# Altium schematic sheet InkJetFin - MCU - MKL05Z32VLF4.SchDoc
size A
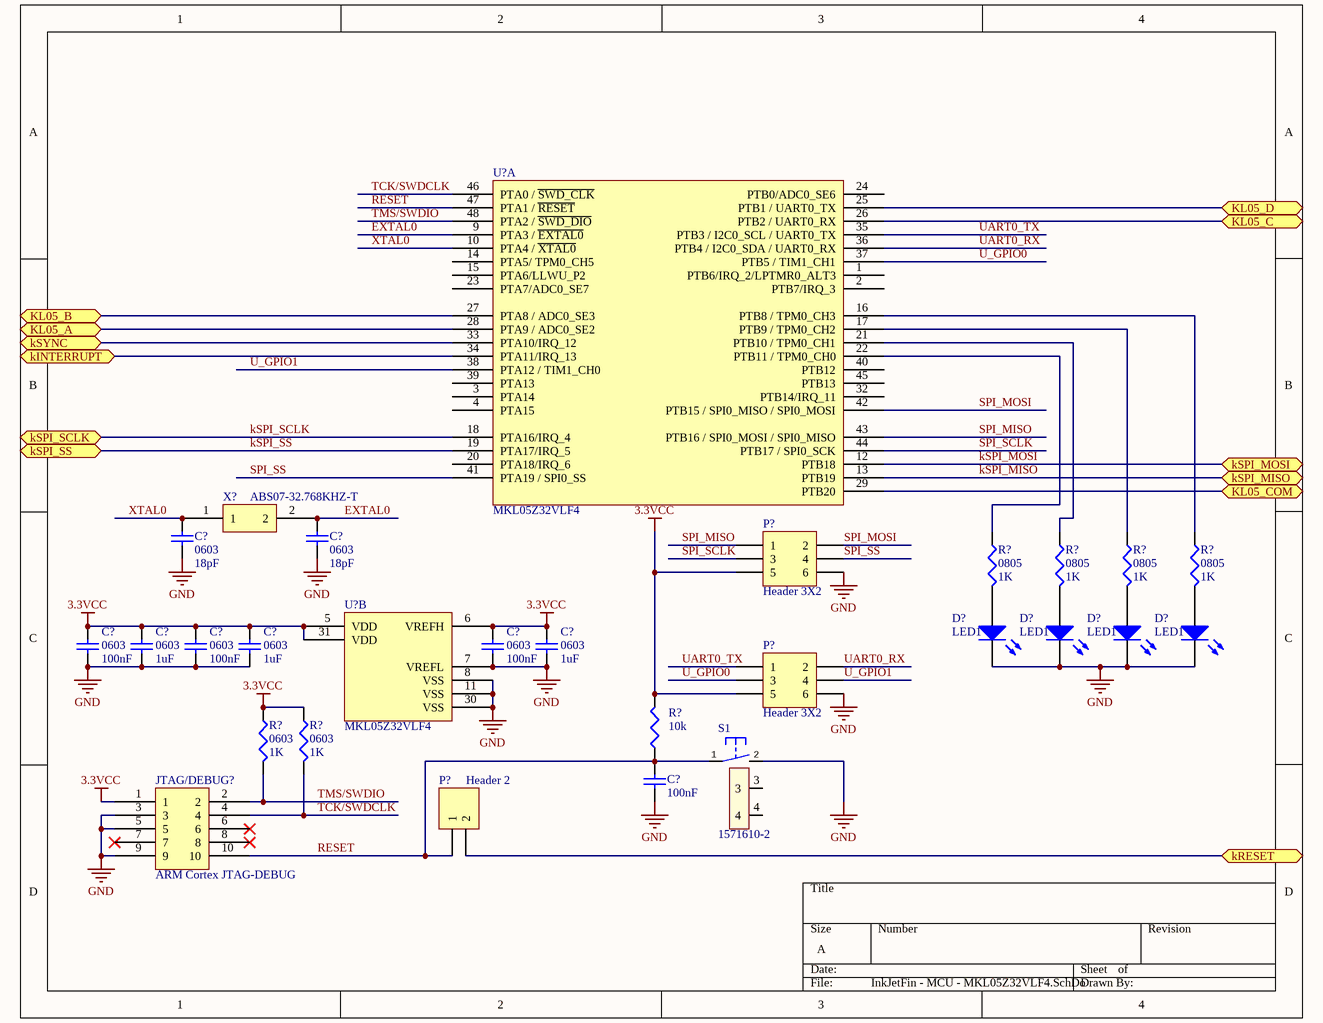
[diagram p0: InkJetFin - MCU - MKL05Z32VLF4.SchDoc]

## Parts
(Parts that share a designator on the sheet are numbered #1, #2 ... from top to bottom, then left to right.)
C?#1  0603  value 18pF  [1608[0603]]
C?#2  0603  value 18pF  [1608[0603]]
C?#3  0603  value 100nF  [1608[0603]]
C?#4  0603  value 1uF  [1608[0603]]
C?#5  0603  value 100nF  [1608[0603]]
C?#6  0603  value 1uF  [1608[0603]]
C?#7  0603  value 100nF  [1608[0603]]
C?#8  0603  value 1uF  [1608[0603]]
C?#9  value 100nF  [1608[0603]]  (hidden comment: Cap Semi)
D?#1  LED1  [SM 0805 polarized]
D?#2  LED1  [SM 0805 polarized]
D?#3  LED1  [SM 0805 polarized]
D?#4  LED1  [SM 0805 polarized]
JTAG/DEBUG?  ARM Cortex JTAG-DEBUG  [FTSH-105-XX-X-DV]
P?#1  Header 3X2  [HDR2X3]
P?#2  Header 3X2  [HDR2X3]
P?#3  Header 2  [HDR1X2]
R?#1  0805  value 1K  [SM 0805 - gap trimmed]
R?#2  0805  value 1K  [SM 0805 - gap trimmed]
R?#3  0805  value 1K  [SM 0805 - gap trimmed]
R?#4  0805  value 1K  [SM 0805 - gap trimmed]
R?#5  0603  value 1K  [J1-0603]
R?#6  0603  value 1K  [J1-0603]
R?#7  value 10k  [J1-0603]  (hidden comment: Res3)
S1  1571610-2  [B3F-31XX]
U?#1  MKL05Z32VLF4  [MKL05Z32VLF4]  (part A of 2)
U?#2  MKL05Z32VLF4  [MKL05Z32VLF4]  (part B of 2)
X?  ABS07-32.768KHZ-T  [ABS07-32.768KHZ-T]

## Ports
kINTERRUPT, KL05_A, KL05_B, KL05_C, KL05_COM, KL05_D, kRESET, kSPI_MISO, kSPI_MOSI, kSPI_SCLK, kSPI_SS, kSYNC

## Nets
3.3VCC: C?#3.1 C?#4.1 C?#5.2 C?#6.2 C?#7.2 C?#8.2 JTAG/DEBUG?.1 P?#1.5 P?#2.5 R?#5.1 R?#6.1 R?#7.2 U?#2.5(VDD) U?#2.6(VREFH) U?#2.31(VDD)
GND: C?#1.2 C?#2.2 C?#3.2 C?#4.2 C?#5.1 C?#6.1 C?#7.1 C?#8.1 C?#9.1 D?#1.1(A) D?#2.1(A) D?#3.1(A) D?#4.1(A) JTAG/DEBUG?.3 JTAG/DEBUG?.5 JTAG/DEBUG?.9 P?#1.6 P?#2.6 S1.2(S) U?#2.7(VREFL) U?#2.8(VSS) U?#2.11(VSS) U?#2.30(VSS)
EXTAL0: C?#2.1 U?#1.9(PTA3_/_~{EXTAL0}) X?.2
kINTERRUPT: U?#1.34(PTA11/IRQ_13) ; port kINTERRUPT
KL05_A: U?#1.28(PTA9_/_ADC0_SE2) ; port KL05_A
KL05_B: U?#1.27(PTA8_/_ADC0_SE3) ; port KL05_B
KL05_C: U?#1.26(PTB2_/_UART0_RX) ; port KL05_C
KL05_COM: U?#1.29(PTB20) ; port KL05_COM
KL05_D: U?#1.25(PTB1_/_UART0_TX) ; port KL05_D
kRESET: P?#3.2 ; port kRESET
kSPI_MISO: U?#1.13(PTB19) ; port kSPI_MISO
kSPI_MOSI: U?#1.12(PTB18) ; port kSPI_MOSI
kSPI_SCLK: U?#1.18(PTA16/IRQ_4) ; port kSPI_SCLK
kSPI_SS: U?#1.19(PTA17/IRQ_5) ; port kSPI_SS
kSYNC: U?#1.33(PTA10/IRQ_12) ; port kSYNC
RESET: C?#9.2 JTAG/DEBUG?.10 P?#3.1 R?#7.1 S1.1(P) U?#1.47(PTA1_/_~{RESET})
SPI_MISO: P?#1.1 U?#1.43(PTB16_/_SPI0_MOSI_/_SPI0_MISO)
SPI_MOSI: P?#1.2 U?#1.42(PTB15_/_SPI0_MISO_/_SPI0_MOSI)
SPI_SCLK: P?#1.3 U?#1.44(PTB17_/_SPI0_SCK)
SPI_SS: P?#1.4 U?#1.41(PTA19_/_SPI0_SS)
TCK/SWDCLK: JTAG/DEBUG?.4 R?#6.2 U?#1.46(PTA0_/_~{SWD_CLK})
TMS/SWDIO: JTAG/DEBUG?.2 R?#5.2 U?#1.48(PTA2_/_~{SWD_DIO})
U_GPIO0: P?#2.3 U?#1.37(PTB5_/_TIM1_CH1)
U_GPIO1: P?#2.4 U?#1.38(PTA12_/_TIM1_CH0)
UART0_RX: P?#2.2 U?#1.36(PTB4_/_I2C0_SDA_/_UART0_RX)
UART0_TX: P?#2.1 U?#1.35(PTB3_/_I2C0_SCL_/_UART0_TX)
XTAL0: C?#1.1 U?#1.10(PTA4_/_~{XTAL0}) X?.1
NetD?#1_2: D?#1.2(K) R?#1.2
NetD?#2_2: D?#2.2(K) R?#2.2
NetD?#3_2: D?#3.2(K) R?#3.2
NetD?#4_2: D?#4.2(K) R?#4.2
NetR?#1_1: R?#1.1 U?#1.22(PTB11_/_TPM0_CH0)
NetR?#2_1: R?#2.1 U?#1.21(PTB10_/_TPM0_CH1)
NetR?#3_1: R?#3.1 U?#1.17(PTB9_/_TPM0_CH2)
NetR?#4_1: R?#4.1 U?#1.16(PTB8_/_TPM0_CH3)

Not connected (* = marked no-connect by the designer): JTAG/DEBUG? 6* 7* 8*; S1 3 4; U?#1 1(PTB6/IRQ_2/LPTMR0_ALT3) 2(PTB7/IRQ_3) 3(PTA14) 4(PTA15) 14(PTA5/_TPM0_CH5) 15(PTA6/LLWU_P2) 20(PTA18/IRQ_6) 23(PTA7/ADC0_SE7) 24(PTB0/ADC0_SE6) 32(PTB14/IRQ_11) 39(PTA13) 40(PTB12) 45(PTB13)

## Library data of the parts
C?#1-C?#9 = Cap Semi: Capacitor (Semiconductor SIM Model); Published: 8-Jun-2000; LatestRevisionDate: 29-May-2009; LatestRevisionNote: IPC-7351 Footprint Added.; PackageReference: C1206; Publisher: Altium Limited; PackageDescription: Chip Capacitor
D?#1-D?#4 = LED1: Typical RED GaAs LED; Published: 8-Jun-2000; LatestRevisionDate: 08-Jul-2005; LatestRevisionNote: Mech Layer 1 removed.; PackageReference: LED-1; Publisher: Altium Limited; PackageDescription: LED; 2 Leads
JTAG/DEBUG? = ARM Cortex JTAG-DEBUG Header
P?#1 P?#2 = Header 3X2: Header, 3-Pin, Dual row; LatestRevisionDate: 17-Jul-2002; LatestRevisionNote: Re-released for DXP Platform.; Publisher: Altium Limited
P?#3 = Header 2: Header, 2-Pin; LatestRevisionDate: 17-Jul-2002; LatestRevisionNote: Re-released for DXP Platform.; Publisher: Altium Limited
R?#1-R?#7 = Res3: Resistor; Published: 8-Jun-2000; LatestRevisionDate: 29-May-2009; LatestRevisionNote: IPC-7351 Footprint Added.; PackageReference: J1-0603; Publisher: Altium Limited; PackageDescription: Chip Resistor
S1 = 1571610-2_1: SWTCH Momentary Washable; Manufacturer: Omron; Manufacturer: TE; LastRevisionNote: Import; ComponentLink1URL: http://www.te.com/commerce/DocumentDelivery/DDEController?Action=srchrtrv&DocNm=1571610&DocType=Customer+Drawing&DocLang=English; ComponentLink1Description: Datasheet for B3F-31XX; Published: 23-Apr-2014; Publisher: UltiMachine; LastRevisionDate: 23-Apr-2014; ManufacturerPartNumber: 1571610-2; Supplier 1: Mouser; Supplier Part Number 1: 506-1571610-2
U?#1 U?#2 = MKL05Z32VLF4: ARM Cortex M0+
X? = ABS07-32.768KHZ-T: ABS07-32.768KHZ-T RTC Crystal Oscillator